# EAGLE schematic strobeshnik-2 (EAGLE 5.04)
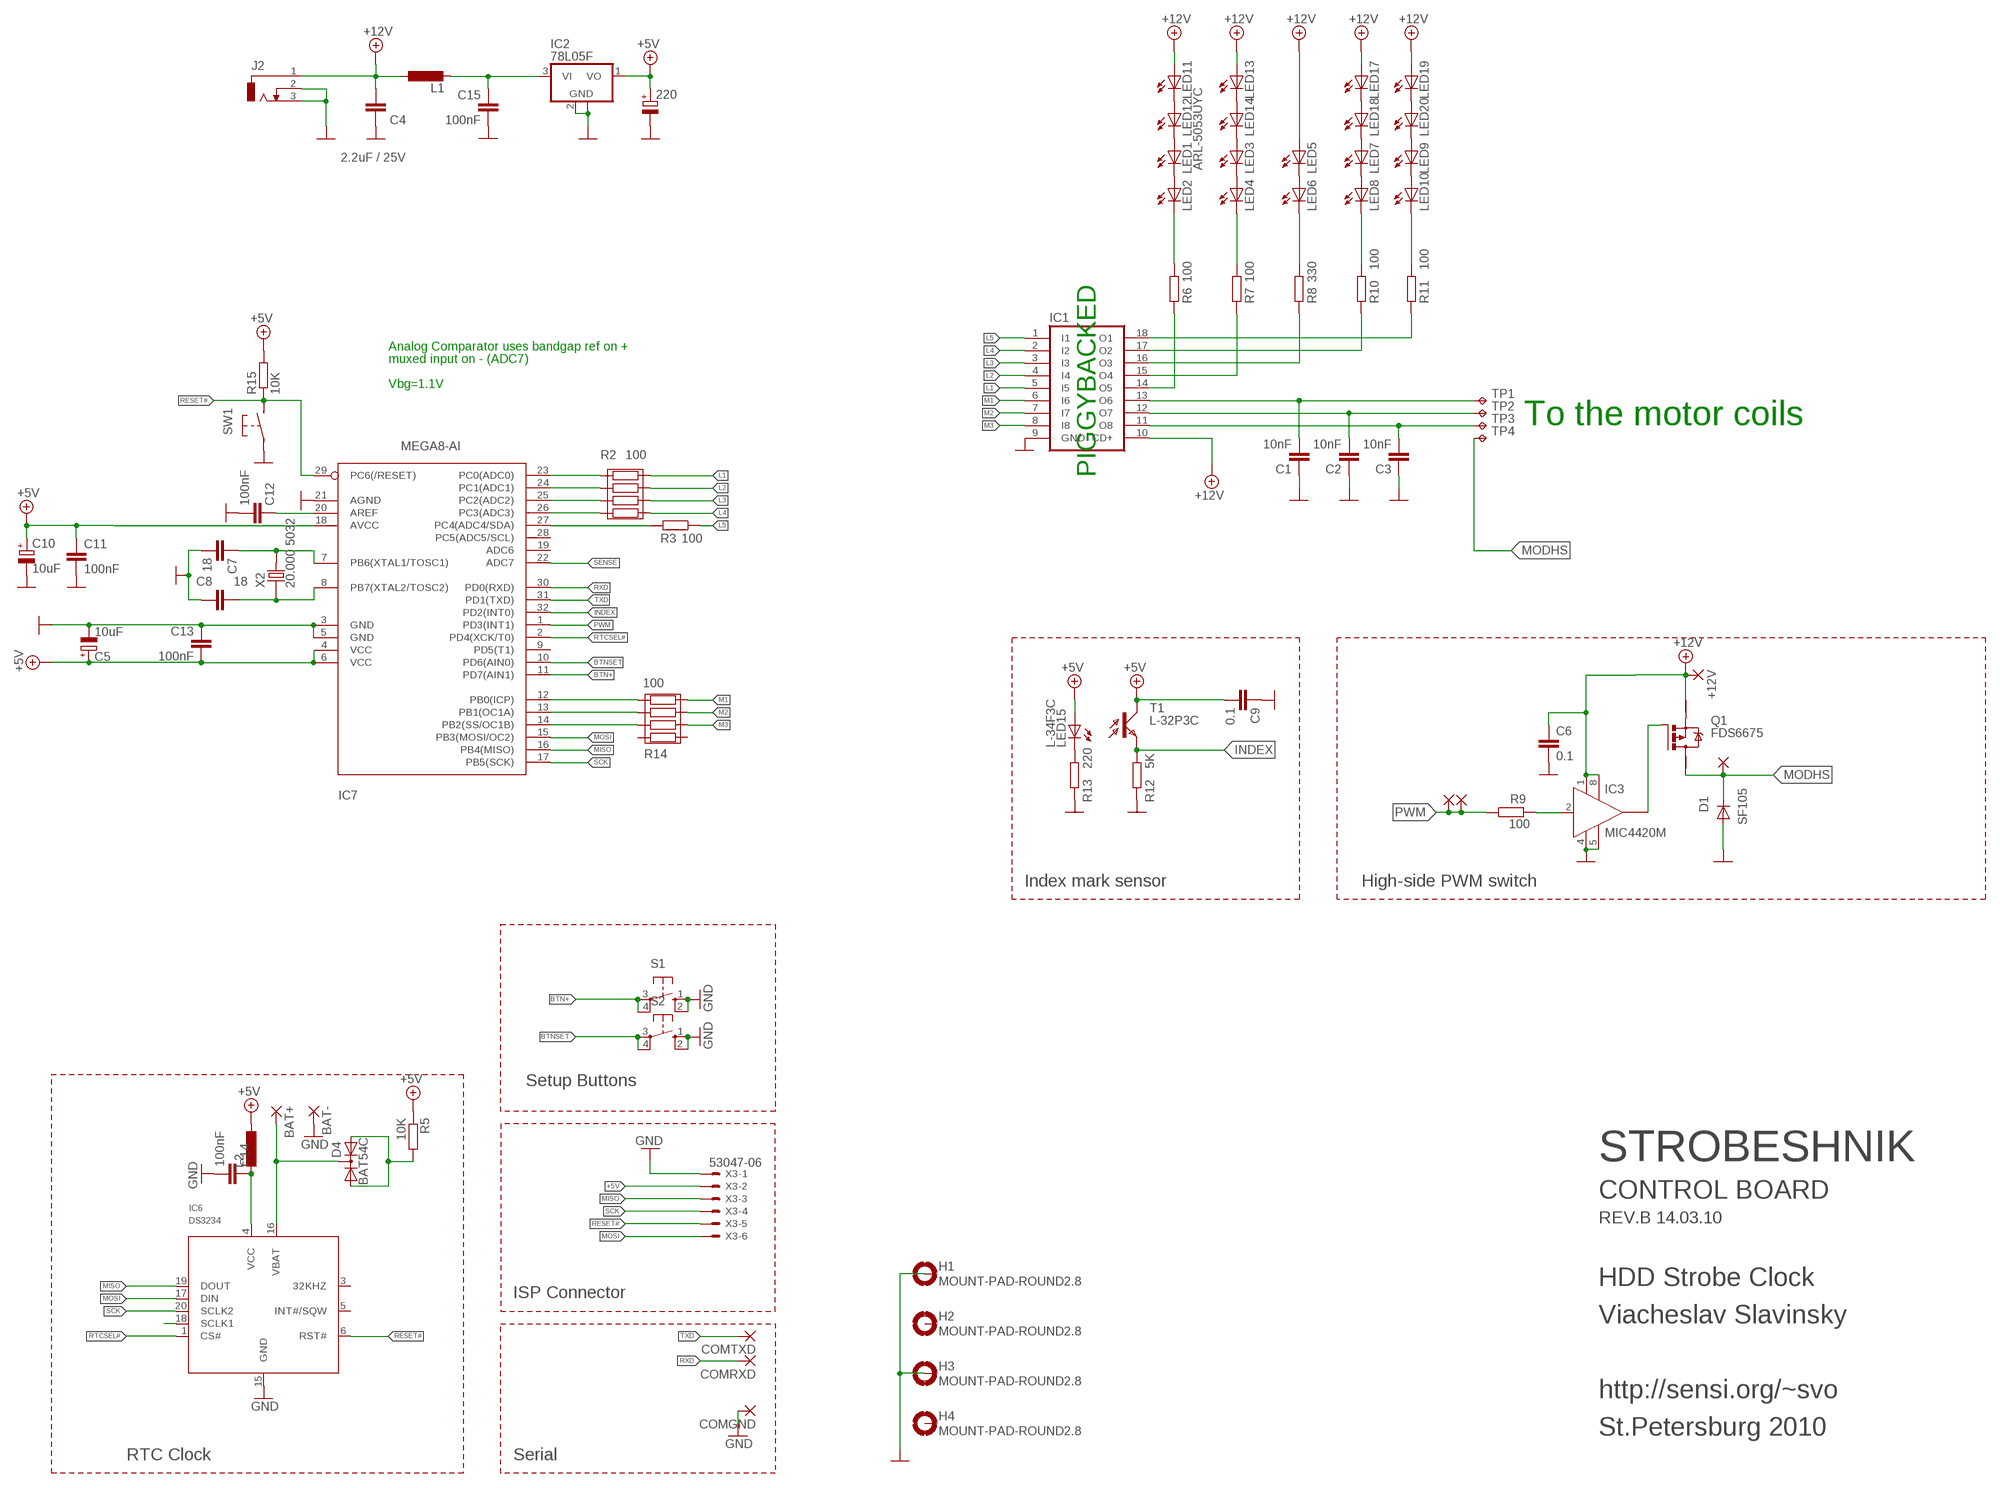
[diagram p0: schematic, sheet 1]

## Parts
220  CPOL-EUD/7343-31R  [D/7343-31R]
+12V  1,6/0,8  [1,6/0,8]
BAT+  1,6/0,8  [1,6/0,8]
BAT-  1,6/0,8  [1,6/0,8]
C1  10nF  C-EUC0805K  [C0805K]
C2  10nF  C-EUC0805K  [C0805K]
C3  10nF  C-EUC0805K  [C0805K]
C4  2.2uF / 25V  C-EUC0805K  [C0805K]
C5  10uF  CPOL-EUSMCB  [SMC_B]
C6  0.1  C-EUC0603K  [C0603K]
C7  18  C-EUC0805K  [C0805K]
C8  18  C-EUC0805K  [C0805K]
C9  0.1  C-EUC0603K  [C0603K]
C10  10uF  CPOL-EUSMCB  [SMC_B]
C11  100nF  C-EUC0603K  [C0603K]
C12  100nF  C-EUC0603K  [C0603K]
C13  100nF  C-EUC0603K  [C0603K]
C14  100nF  C-EUC0603K  [C0603K]
C15  100nF  C-EUC0603K  [C0603K]
COMGND  1,6/0,8  [1,6/0,8]
COMRXD  1,6/0,8  [1,6/0,8]
COMTXD  1,6/0,8  [1,6/0,8]
D1  SF105  1N4004  [DO41-10]
D4  BAT54C  DIODE-2AC|CASOT23  [SOT23@1]
H1  MOUNT-PAD-ROUND2.8  [2,8-PAD]
H2  MOUNT-PAD-ROUND2.8  [2,8-PAD]
H3  MOUNT-PAD-ROUND2.8  [2,8-PAD]
H4  MOUNT-PAD-ROUND2.8  [2,8-PAD]
IC1  ULN2803A  [DIL18]
IC2  78L05F  [SOT89]
IC3  MIC4420M  [SO-08]
IC6  DS3234  [SO-20DW]
IC7  MEGA8-AI  [TQFP32-08]
J2  DCJ-SMALL  [DCJ-SMALL]
L1  L-EUL4532P  [L4532P]
L2  L-EUL3230M  [L3230M]
LED1  ARL-5053UYC  LED5MM  [LED5MM]
LED2  LED5MM  [LED5MM]
LED3  LED5MM  [LED5MM]
LED4  LED5MM  [LED5MM]
LED5  LED5MM  [LED5MM]
LED6  LED5MM  [LED5MM]
LED7  LED5MM  [LED5MM]
LED8  LED5MM  [LED5MM]
LED9  LED5MM  [LED5MM]
LED10  LED5MM  [LED5MM]
LED11  LED5MM  [LED5MM]
LED12  LED5MM  [LED5MM]
LED13  LED5MM  [LED5MM]
LED14  LED5MM  [LED5MM]
LED15  L-34F3C  LED3MM  [LED3MM]
LED17  LED5MM  [LED5MM]
LED18  LED5MM  [LED5MM]
LED19  LED5MM  [LED5MM]
LED20  LED5MM  [LED5MM]
MOTHS  1,6/0,8  [1,6/0,8]
PWM  1,6/0,8  [1,6/0,8]
PWM1  1,6/0,8  [1,6/0,8]
Q1  FDS6675  P-MOSFET-SO8  [SO-08]
R2  100  RES4  [RESSMD-YC16]
R3  100  R-EU_R0805  [R0805]
R5  10K  R-EU_R0805  [R0805]
R6  100  R-EU_R0805  [R0805]
R7  100  R-EU_R0805  [R0805]
R8  330  R-EU_R0805  [R0805]
R9  100  R-EU_R0805  [R0805]
R10  100  R-EU_R0805  [R0805]
R11  100  R-EU_R0805  [R0805]
R12  5K  R-EU_R0805  [R0805]
R13  220  R-EU_R0805  [R0805]
R14  100  RES4  [RESSMD-YC16]
R15  10K  R-EU_R0805  [R0805]
S1  10-XX  [B3F-10XX]
S2  10-XX  [B3F-10XX]
SW1  BUTTON-IT_1181  [SW_IT1181]
T1  L-32P3C  BPX81  [BPX81]
TP1  TPPAD1-13Y  [P1-13Y]
TP2  TPPAD1-13Y  [P1-13Y]
TP3  TPPAD1-13Y  [P1-13Y]
TP4  TPPAD1-13Y  [P1-13Y]
X2  20.000 5032  XTAL0532  [XTAL_0532]
X3  53047-06  [53047-06]

## Nets
+5V: 220.+ C5.+ C9.2 C10.+ C11.1 C13.2 IC2.1(VO) IC7.4(VCC) IC7.6(VCC) IC7.18(AVCC) L2.1 LED15.A R5.1 R15.2 T1.C X3.2
+12V [supply1]: +12V.1(P) C4.2 C6.1 IC1.10(CD+) IC3.1(VS) IC3.8(VS1) J2.1 L1.1 LED5.A LED11.A LED13.A LED17.A LED19.A Q1.1(S)
BTN+: IC7.11(PD7(AIN1)) S1.3(P) S1.4(P1)
BTNSET: IC7.10(PD6(AIN0)) S2.3(P) S2.4(P1)
GND: 220.- BAT-.1(P) C1.1 C2.1 C3.1 C4.1 C5.- C6.2 C7.2 C8.2 C9.1 C10.- C11.2 C12.2 C13.1 C14.2 C15.2 COMGND.1(P) D1.A H1.B2,8(MOUNT) H3.B2,8(MOUNT) IC1.9(GND) IC2.2(GND) IC2.2@1(GND) IC3.4(GND) IC3.5(GND1) IC6.15(GND) IC7.3(GND) IC7.5(GND) IC7.21(AGND) J2.2 J2.3 R12.2 R13.2 S1.1(S) S1.2(S1) S2.1(S) S2.2(S1) SW1.P$1(P1) X3.1
INDEX: IC7.32(PD2(INT0)) R12.1 T1.E
L1: IC1.5(I5) R2.R4$2(4.2)
L1X: IC7.23(PC0(ADC0)) R2.R4$1(4.1)
L2: IC1.4(I4) R2.R3$2(3.2)
L2X: IC7.24(PC1(ADC1)) R2.R3$1(3.1)
L3: IC1.3(I3) R2.R2$2(2.2)
L3X: IC7.25(PC2(ADC2)) R2.R2$1(2.1)
L4: IC1.2(I2) R2.R1$2(1.2)
L4X: IC7.26(PC3(ADC3)) R2.R1$1(1.1)
L5: IC1.1(I1) R3.1
L5X: IC7.27(PC4(ADC4/SDA)) R3.2
LL1: IC1.14(O5) R6.2
LL2: IC1.15(O4) R7.2
LL3: IC1.16(O3) R8.2
LL4: IC1.17(O2) R10.2
LL5: IC1.18(O1) R11.2
M1: IC1.6(I6) R14.R4$2(4.2)
M2: IC1.7(I7) R14.R3$2(3.2)
M3: IC1.8(I8) R14.R2$2(2.2)
MISO: IC6.19(DOUT) IC7.16(PB4(MISO)) X3.3
MODHS: D1.C MOTHS.1(P) Q1.5(D) TP4.1(TP)
MOSI: IC6.17(DIN) IC7.15(PB3(MOSI/OC2)) X3.6
N$1: D4.1(A1) D4.2(A2) R5.2
N$2: IC6.18(SCLK1)
N$3: C12.1 IC7.20(AREF)
N$4: IC3.2(IN) R9.2
N$5: C15.1 IC2.3(VI) L1.2
N$6: IC3.6(OUT) Q1.4(G)
N$9: BAT+.1(P) D4.3(C) IC6.16(VBAT)
N$10: C1.2 IC1.13(O6) TP1.1(TP)
N$11: C2.2 IC1.12(O7) TP2.1(TP)
N$12: C3.2 IC1.11(O8) TP3.1(TP)
N$14: LED1.K(C) LED2.A
N$15: LED3.K(C) LED4.A
N$16: LED5.K(C) LED6.A
N$17: LED7.K(C) LED8.A
N$18: LED9.K(C) LED10.A
N$19: LED2.K(C) R6.1
N$20: LED4.K(C) R7.1
N$21: LED6.K(C) R8.1
N$22: LED8.K(C) R10.1
N$23: LED10.K(C) R11.1
N$25: LED1.A LED12.K(C)
N$26: LED11.K(C) LED12.A
N$27: LED13.K(C) LED14.A
N$29: LED17.K(C) LED18.A
N$30: LED19.K(C) LED20.A
N$31: IC7.14(PB2(SS/OC1B)) R14.R2$1(2.1)
N$32: IC7.13(PB1(OC1A)) R14.R3$1(3.1)
N$33: LED15.K(C) R13.1
N$34: IC7.12(PB0(ICP)) R14.R4$1(4.1)
N$40: LED3.A LED14.K(C)
N$41: LED7.A LED18.K(C)
N$42: LED9.A LED20.K(C)
N$53: C14.1 IC6.4(VCC) L2.2
PWM: IC7.1(PD3(INT1)) PWM1.1(P) PWM.1(P) R9.1
RESET#: IC6.6(RST#) IC7.29(PC6(/RESET)) R15.1 SW1.P$2(P2) X3.5
RTCSEL#: IC6.1(CS#) IC7.2(PD4(XCK/T0))
RXD: COMRXD.1(P) IC7.30(PD0(RXD))
SCK: IC6.20(SCLK2) IC7.17(PB5(SCK)) X3.4
SENSE: IC7.22(ADC7)
TXD: COMTXD.1(P) IC7.31(PD1(TXD))
XTAL1: C7.1 IC7.7(PB6(XTAL1/TOSC1)) X2.4
XTAL2: C8.1 IC7.8(PB7(XTAL2/TOSC2)) X2.2
Unconnected: H2.B2,8(MOUNT) H4.B2,8(MOUNT) IC3.7(OUT) IC6.3(32KHZ) IC6.5(INT#/SQW) IC7.9(PD5(T1)) IC7.19(ADC6) IC7.28(PC5(ADC5/SCL)) Q1.2(S) Q1.3(S) Q1.6(D) Q1.7(D) Q1.8(D) R14.R1$1(1.1) R14.R1$2(1.2)

## Notes on the sheet
- Analog Comparator uses bandgap ref on +
- muxed input on - (ADC7)
- Vbg=1.1V
- To the motor coils
- PIGGYBACKED
- Index mark sensor | High-side PWM switch
- Setup Buttons
- STROBESHNIK
- CONTROL BOARD
- REV.B 14.03.10
- HDD Strobe Clock
- ISP Connector
- Viacheslav Slavinsky
- http://sensi.org/~svo
- St.Petersburg 2010
- RTC Clock | Serial

## Library data of the parts
220 C5 C10 = rcl:CPOL-EU: POLARIZED CAPACITOR, European symbol
+12V BAT+ BAT- COMGND COMRXD COMTXD MOTHS PWM PWM1 = wirepad:1,6/0,8: THROUGH-HOLE PAD
C1-C4 C6-C9 C11-C15 = rcl:C-EU: CAPACITOR, European symbol
D1 = diode:1N4004: DIODE general purpose rectifier, 1 A
D4 = diode:DIODE-2AC|CA: Dual DIODE Anode-Cathode|Cathode-Anode
H1-H4 = holes:MOUNT-PAD-ROUND: MOUNTING PAD, round
IC1 = uln-udn:ULN2803A: DRIVER ARRAY
IC2 = linear:78L*: POSITOIV-VOLTAGE REGULATORS Output up to 100 mA Source: http://focus.ti.com/lit/ds/symlink/ua78l05.pdf
IC3 = transistor-power:MIC4420: 6A-Peak Low-Side MOSFET Driver Bipolar/CMOS/DMOS Process http://www.micrel.com/_PDF/mic4420.pdf
IC6 = 0-ds3234:DS3234*: Extremely Accurate SPI Bus RTC with Integrated Crystal and SRAM The DS3234 is a low-cost, extremely accurate SPI? bus real-time clock (RTC) with an integrated temperature-com- pensated crystal oscillator (TCXO) and crystal. The DS3234 incorporates a precision, temperature-compen- sated voltage reference and comparator circuit to monitor VCC. When VCCdrops below the power-fail voltage (VPF), the device asserts the RSToutput and also disables read and write access to the part when VCCdrops below both VPFand VBAT. The RSTpin is monitored as a pushbutton input for generating a µP reset. The device switches to the backup supply input and maintains accurate timekeeping when main power to the device is interrupted. The integra- tion of the crystal resonator enhances the long-term accu- racy of the device as well as reduces the piece-part count in a manufacturing line. The DS3234 is available in com- mercial and industrial temperature ranges, and is offered in an industry-standard 300-mil, 20-pin SO package. The DS3234 also integrates 256 bytes of battery-backed SRAM. In the event of main power loss, the contents of the memory are maintained by the power source con- nected to the VBATpin. The RTC maintains seconds, minutes, hours, day, date, month, and year information. The date at the end of the month is automatically adjust- ed for months with fewer than 31 days, including correc- tions for leap year. The clock operates in either the 24-hour or 12-hour format with AM/PM indicator. Two programmable time-of-day alarms and a programmable square-wave output are provided. Address and data are transferred serially by an SPI bidirectional bus. Accuracy ±2ppm from 0°C to +40°C Accuracy ±3.5ppm from -40°C to +85°C Battery Backup Input for Continuous Timekeeping Operating Temperature Ranges Commercial: 0°C to +70°C Industrial: -40°C to +85°C Low-Power Consumption Real-Time Clock Counts Seconds, Minutes, Hours, Day, Date, Month, and Year with Leap Year Compensation Valid Up to 2099 Two Time-of-Day Alarms Programmable Square-Wave Output 4MHz SPI Bus Supports Modes 1 and 3 Digital Temp Sensor Output: ±3°C Accuracy Register for Aging Trim RSTInput/Output 300-Mil, 20-Pin SO Package Underwriters Laboratories (UL®) Recognized
IC7 = atmel:MEGA8: MICROCONTROLLER 8 Kbytes FLASH, 1 kbytes SRAM, 512 bytes EEPROM, USART, 6-channel 10 bit ADC, 2-channel 8 bit ADC Pin compatible with Atmega48, ATMega88, ATMega168 Source: avr.lbr
J2 = 0-svo:DCJ-SMALL: Smaller DC power jack
L1 L2 = rcl:L-EU: INDUCTOR, European symbol
LED1-LED15 LED17-LED20 = 0-svo:LED: LED OSRAM: - CHIPLED LG R971, LG N971, LY N971, LG Q971, LY Q971, LO R971, LY R971 LH N974, LH R974 LS Q976, LO Q976, LY Q976 LO Q996 - Hyper CHIPLED LW Q18S LB Q993, LB Q99A, LB R99A - SideLED LS A670, LO A670, LY A670, LG A670, LP A670 LB A673, LV A673, LT A673, LW A673 LH A674 LY A675 LS A676, LA A676, LO A676, LY A676, LW A676 LS A679, LY A679, LG A679 - Hyper Micro SIDELED® LS Y876, LA Y876, LO Y876, LY Y876 LT Y87S - SmartLED LW L88C, LW L88S LB L89C, LB L89S, LG L890 LS L89K, LO L89K, LY L89K LS L896, LA L896, LO L896, LY L896 - TOPLED LS T670, LO T670, LY T670, LG T670, LP T670 LSG T670, LSP T670, LSY T670, LOP T670, LYG T670 LG T671, LOG T671, LSG T671 LB T673, LV T673, LT T673, LW T673 LH T674 LS T676, LA T676, LO T676, LY T676, LB T676, LH T676, LSB T676, LW T676 LB T67C, LV T67C, LT T67C, LS T67K, LO T67K, LY T67K, LW E67C LS E67B, LA E67B, LO E67B, LY E67B, LB E67C, LV E67C, LT E67C LW T67C LS T679, LY T679, LG T679 LS T770, LO T770, LY T770, LG T770, LP T770 LB T773, LV T773, LT T773, LW T773 LH T774 LS E675, LA E675, LY E675, LS T675 LS T776, LA T776, LO T776, LY T776, LB T776 LHGB T686 LT T68C, LB T68C - Hyper Mini TOPLED® LB M676 - Mini TOPLED Santana® LG M470 LS M47K, LO M47K, LY M47K Source: http://www.osram.convergy.de/
Q1 = transistor-power:P-MOSFET-SO8: P-Channel MOSFET Example: FDS4435A; P-Channel Logic Level PowerTrench® MOSFET FDS4465; P-Channel 1.8V Specified PowerTrench® MOSFET Source: www.fairchildsemi.com
R2 R14 = 0-svo:RES4
R3 R5-R13 R15 = rcl:R-EU_: RESISTOR, European symbol
S1 S2 = switch-omron:10-XX: OMRON SWITCH
SW1 = 0-svo:BUTTON-IT_1181
T1 = opto-trans-siemens:BPX81: PHOTO TRANSISTOR
TP1-TP4 = testpad:TP: Test pad
X2 = 0-svo:XTAL0532: SMD Type 0532 (5x3.2mm) XTAL
X3 = con-molex:53?-06: CONNECTOR wire to board 1.25 mm (.049 inch) pitch header

## Net classes
0 default: width 0.3 mm, drill 0.6 mm, clearance 0.25 mm
1 supply1: width 0.4 mm, drill 0.6 mm, clearance 0.4 mm
2 supply2: width 0.6 mm, drill 0.6 mm, clearance 0.4 mm